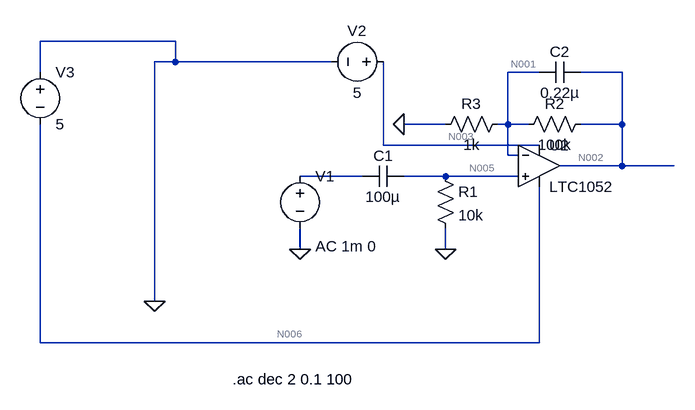
[diagram p0: schematic 40dB Amplifier.asc]
40dB Amplifier.asc, the LTspice schematic file:
Version 4
SHEET 1 880 680
WIRE -256 -112 -464 -112
WIRE -256 -80 -256 -112
WIRE -256 -80 -288 -80
WIRE -16 -80 -256 -80
WIRE -464 -64 -464 -112
WIRE 304 -64 256 -64
WIRE 432 -64 368 -64
WIRE 160 16 96 16
WIRE 256 16 256 -64
WIRE 256 16 240 16
WIRE 288 16 256 16
WIRE 432 16 432 -64
WIRE 432 16 368 16
WIRE 64 48 64 -80
WIRE 304 48 64 48
WIRE 256 64 256 16
WIRE 272 64 256 64
WIRE 432 80 432 16
WIRE 432 80 336 80
WIRE 512 80 432 80
WIRE 32 96 -64 96
WIRE 160 96 96 96
WIRE 272 96 160 96
WIRE -64 208 -64 176
WIRE 160 208 160 176
WIRE -288 288 -288 -80
WIRE -464 352 -464 16
WIRE 304 352 304 112
WIRE 304 352 -464 352
FLAG 96 16 0
FLAG -64 208 0
FLAG 160 208 0
FLAG -288 288 0
SYMBOL voltage -64 80 R0
WINDOW 123 24 124 Left 2
WINDOW 39 0 0 Left 2
SYMATTR Value2 AC 1m 0
SYMATTR InstName V1
SYMATTR Value ""
SYMBOL cap 32 112 R270
WINDOW 0 32 32 VTop 2
WINDOW 3 0 32 VBottom 2
SYMATTR InstName C1
SYMATTR Value 100µ
SYMBOL res 144 80 R0
SYMATTR InstName R1
SYMATTR Value 10k
SYMBOL cap 304 -48 R270
WINDOW 0 32 32 VTop 2
WINDOW 3 0 32 VBottom 2
SYMATTR InstName C2
SYMATTR Value 0.22µ
SYMBOL res 272 32 R270
WINDOW 0 32 56 VTop 2
WINDOW 3 0 56 VBottom 2
SYMATTR InstName R2
SYMATTR Value 100k
SYMBOL res 144 32 R270
WINDOW 0 32 56 VTop 2
WINDOW 3 0 56 VBottom 2
SYMATTR InstName R3
SYMATTR Value 1k
SYMBOL voltage 80 -80 R90
WINDOW 0 -32 56 VBottom 2
WINDOW 3 32 56 VTop 2
WINDOW 123 0 0 Left 2
WINDOW 39 0 0 Left 2
SYMATTR InstName V2
SYMATTR Value 5
SYMBOL Opamps\\LTC1052 304 16 R0
SYMATTR InstName U2
SYMBOL voltage -464 -80 R0
WINDOW 123 0 0 Left 2
WINDOW 39 0 0 Left 2
SYMATTR InstName V3
SYMATTR Value 5
TEXT -168 408 Left 2 !.ac dec 2 0.1 100

The netlist it stands for:
* 40dB Amplifier.asc
V1 N004 0 AC 1m 0
C1 N004 N005 100µ
R1 N005 0 10k
C2 N001 N002 0.22µ
R2 N001 N002 100k
R3 0 N001 1k
V2 N003 0 5
XU2 N005 N001 N003 N006 N002 LTC1052  ; pins In+ In- V+ V- OUT
V3 0 N006 5
.ac dec 2 0.1 100
.backanno
.end

* Results of the author's LTspice run, read from the files saved beside the schematic
* Operating Point, zero values left out:
*   V(n002) = -39.97 nV
*   V(n003) = 5 V
*   V(n006) = -5 V
*   I(V3) = -1.7 mA
*   I(V2) = -1.7 mA
*   Ix(u2:3) = 1.7 mA
*   Ix(u2:4) = -1.7 mA
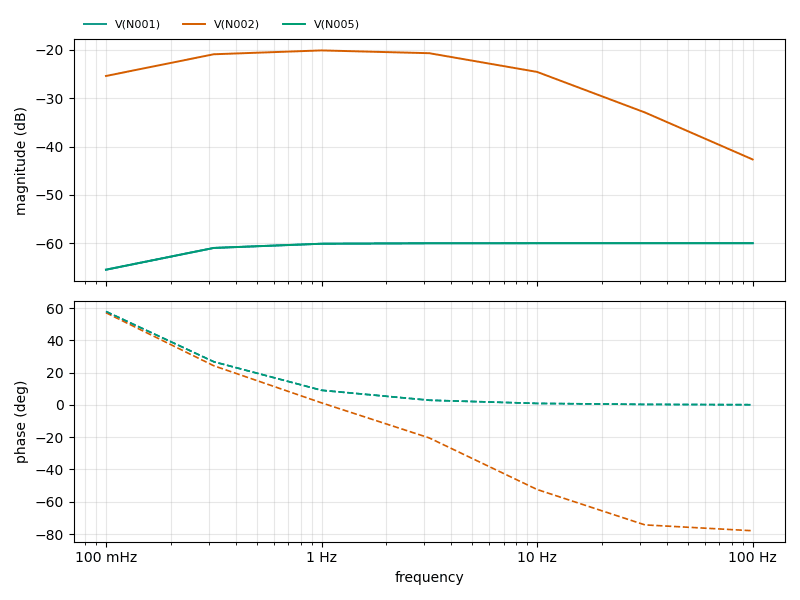
[diagram p1: AC Analysis of 40dB Amplifier.asc, plotted from the saved traces]
* AC Analysis, 1 run:
*   V(N001): -65.48 dB at 100 mHz, -60.00 dB at 100 Hz, peak -60.00 dB at 31.62 Hz, 3 dB below the peak at 188 mHz
*   V(N002): -25.40 dB at 100 mHz, -42.67 dB at 100 Hz, peak -20.10 dB at 1 Hz, 3 dB below the peak at 179.4 mHz and 6.515 Hz
*   V(N005): -65.48 dB at 100 mHz, -60.00 dB at 100 Hz, peak -60.00 dB at 100 Hz, 3 dB below the peak at 188.2 mHz